# EAGLE design Main Board (EAGLE 9.6.2)
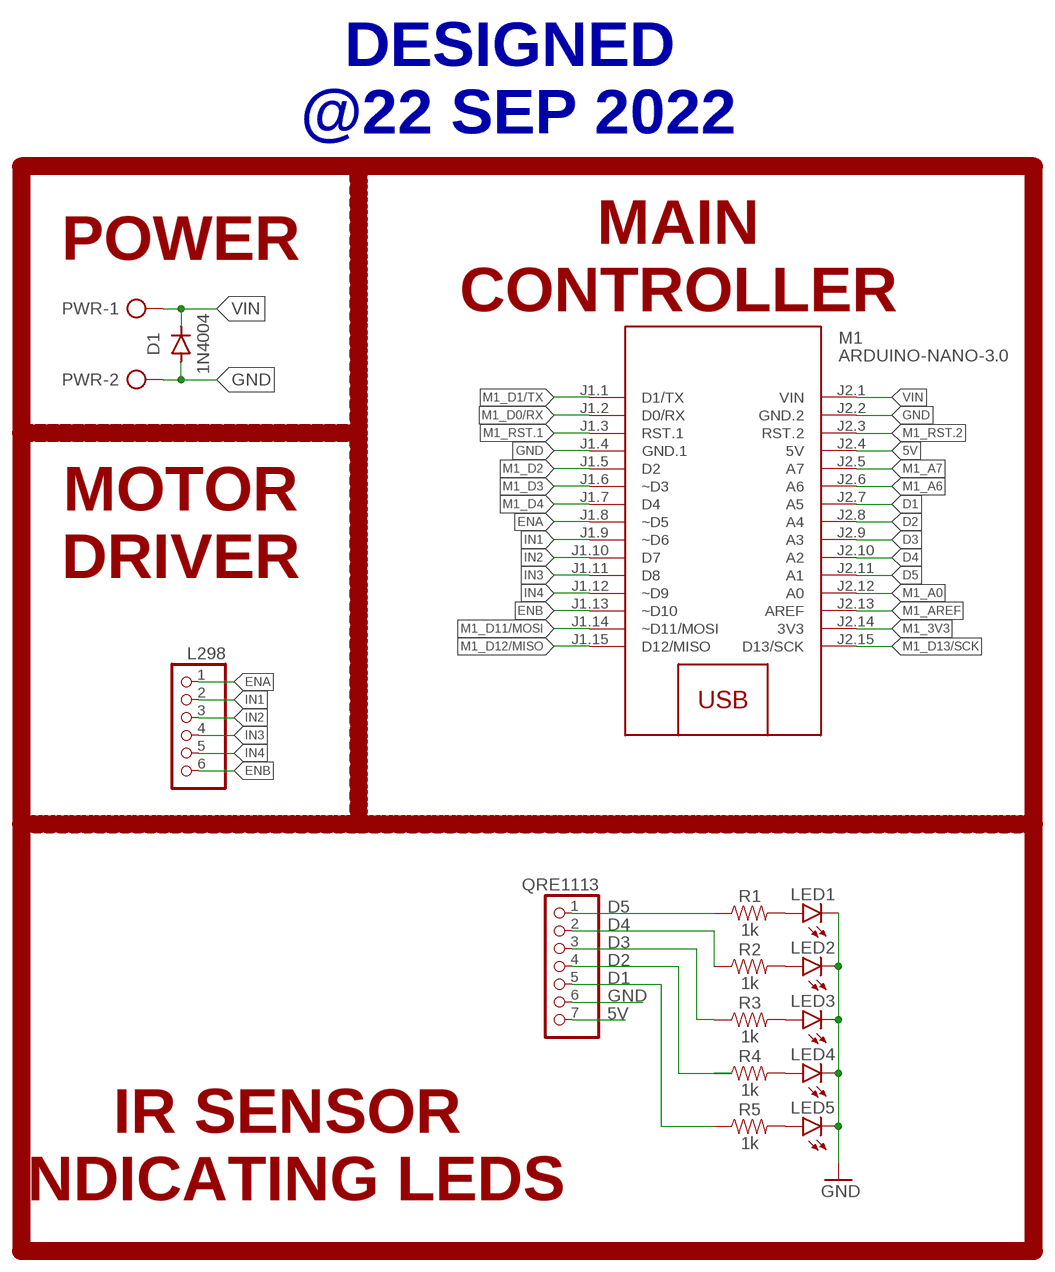
[diagram p0: schematic, sheet 1]

## Parts
D1  1N4004  [DO41-10]
L298  PINHD-1X6  [1X06]
LED1  LED5MM  [LED5MM]
LED2  LED5MM  [LED5MM]
LED3  LED5MM  [LED5MM]
LED4  LED5MM  [LED5MM]
LED5  LED5MM  [LED5MM]
M1  ARDUINO-NANO-3.0  [ARDUINO-NANO-3.0]
PWR  2P  [2P]
QRE1113  PINHD-1X7/90  [1X07/90]
R1  1k  RESISTORAXIAL-0.3  [AXIAL-0.3]
R2  1k  RESISTORAXIAL-0.3  [AXIAL-0.3]
R3  1k  RESISTORAXIAL-0.3  [AXIAL-0.3]
R4  1k  RESISTORAXIAL-0.3  [AXIAL-0.3]
R5  1k  RESISTORAXIAL-0.3  [AXIAL-0.3]

## Nets
5V: M1.J2.4(5V) QRE1113.7
D1: M1.J2.7(A5) QRE1113.5 R5.P$1
D2: M1.J2.8(A4) QRE1113.4 R4.P$1
D3: M1.J2.9(A3) QRE1113.3 R3.P$1
D4: M1.J2.10(A2) QRE1113.2 R2.P$1
D5: M1.J2.11(A1) QRE1113.1 R1.P$1
ENA: L298.1 M1.J1.8(~D5)
ENB: L298.6 M1.J1.13(~D10)
GND: D1.A LED1.K(C) LED2.K(C) LED3.K(C) LED4.K(C) LED5.K(C) M1.J1.4(GND.1) M1.J2.2(GND.2) PWR.2 QRE1113.6
IN1: L298.2 M1.J1.9(~D6)
IN2: L298.3 M1.J1.10(D7)
IN3: L298.4 M1.J1.11(D8)
IN4: L298.5 M1.J1.12(~D9)
M1_3V3: M1.J2.14(3V3)
M1_A0: M1.J2.12(A0)
M1_A6: M1.J2.6(A6)
M1_A7: M1.J2.5(A7)
M1_AREF: M1.J2.13(AREF)
M1_D0/RX: M1.J1.2(D0/RX)
M1_D1/TX: M1.J1.1(D1/TX)
M1_D2: M1.J1.5(D2)
M1_D3: M1.J1.6(~D3)
M1_D4: M1.J1.7(D4)
M1_D11/MOSI: M1.J1.14(~D11/MOSI)
M1_D12/MISO: M1.J1.15(D12/MISO)
M1_D13/SCK: M1.J2.15(D13/SCK)
M1_RST.1: M1.J1.3(RST.1)
M1_RST.2: M1.J2.3(RST.2)
N$1: LED1.A R1.P$2
N$2: LED2.A R2.P$2
N$3: LED3.A R3.P$2
N$4: LED4.A R4.P$2
N$5: LED5.A R5.P$2
VIN: D1.C M1.J2.1(VIN) PWR.1

## Notes on the sheet
- DESIGNED 
  @22 SEP 2022
- POWER
- MAIN
  CONTROLLER
- MOTOR
  DRIVER
- IR SENSOR
  INDICATING LEDS

## Library data of the parts
D1 = diode:1N4004: DIODE general purpose rectifier, 1 A
L298 = pinhead:PINHD-1X6: PIN HEADER
LED1-LED5 = led:LED: LED OSRAM: - CHIPLED LG R971, LG N971, LY N971, LG Q971, LY Q971, LO R971, LY R971 LH N974, LH R974 LS Q976, LO Q976, LY Q976 LO Q996 - Hyper CHIPLED LW Q18S LB Q993, LB Q99A, LB R99A - SideLED LS A670, LO A670, LY A670, LG A670, LP A670 LB A673, LV A673, LT A673, LW A673 LH A674 LY A675 LS A676, LA A676, LO A676, LY A676, LW A676 LS A679, LY A679, LG A679 - Hyper Micro SIDELED® LS Y876, LA Y876, LO Y876, LY Y876 LT Y87S - SmartLED LW L88C, LW L88S LB L89C, LB L89S, LG L890 LS L89K, LO L89K, LY L89K LS L896, LA L896, LO L896, LY L896 - TOPLED LS T670, LO T670, LY T670, LG T670, LP T670 LSG T670, LSP T670, LSY T670, LOP T670, LYG T670 LG T671, LOG T671, LSG T671 LB T673, LV T673, LT T673, LW T673 LH T674 LS T676, LA T676, LO T676, LY T676, LB T676, LH T676, LSB T676, LW T676 LB T67C, LV T67C, LT T67C, LS T67K, LO T67K, LY T67K, LW E67C LS E67B, LA E67B, LO E67B, LY E67B, LB E67C, LV E67C, LT E67C LW T67C LS T679, LY T679, LG T679 LS T770, LO T770, LY T770, LG T770, LP T770 LB T773, LV T773, LT T773, LW T773 LH T774 LS E675, LA E675, LY E675, LS T675 LS T776, LA T776, LO T776, LY T776, LB T776 LHGB T686 LT T68C, LB T68C - Hyper Mini TOPLED® LB M676 - Mini TOPLED Santana® LG M470 LS M47K, LO M47K, LY M47K Source: http://www.osram.convergy.de LUXEON: - LUMILED® LXK2-PW12-R00, LXK2-PW12-S00, LXK2-PW14-U00, LXK2-PW14-V00 LXK2-PM12-R00, LXK2-PM12-S00, LXK2-PM14-U00 LXK2-PE12-Q00, LXK2-PE12-R00, LXK2-PE12-S00, LXK2-PE14-T00, LXK2-PE14-U00 LXK2-PB12-K00, LXK2-PB12-L00, LXK2-PB12-M00, LXK2-PB14-N00, LXK2-PB14-P00, LXK2-PB14-Q00 LXK2-PR12-L00, LXK2-PR12-M00, LXK2-PR14-Q00, LXK2-PR14-R00 LXK2-PD12-Q00, LXK2-PD12-R00, LXK2-PD12-S00 LXK2-PH12-R00, LXK2-PH12-S00 LXK2-PL12-P00, LXK2-PL12-Q00, LXK2-PL12-R00 Source: www.luxeon.com KINGBRIGHT: KA-3528ASYC Source: www.kingbright.com
M1 = Modules:ARDUINO-NANO-3.0: Arduino Nano 3.0 and compatible devices More details available here: https://www.arduino.cc/en/Main/ArduinoBoardNano Click here to find device on ebay.com <http://www.ebay.com/sch/arduino+nano>
PWR = Terminal Block:2P: CONNECTOR
QRE1113 = pinhead:PINHD-1X7: PIN HEADER
R1-R5 = SparkFun-Resistors:RESISTOR: Generic Resistor Package

## Board
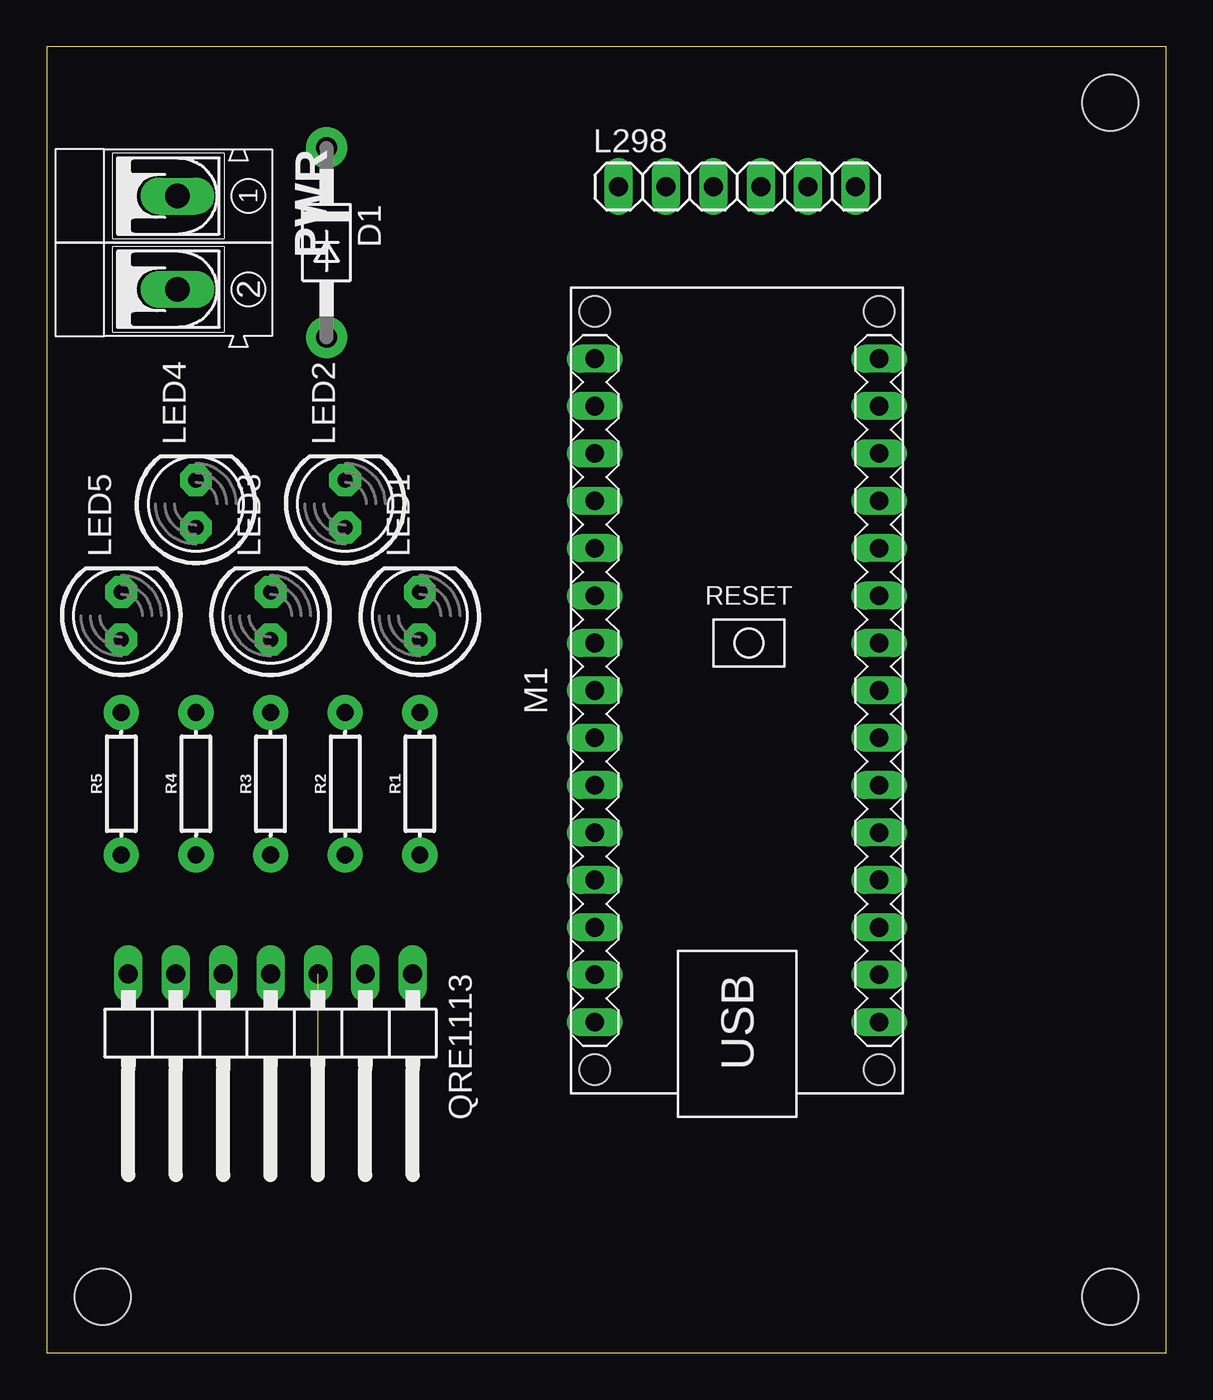
[diagram p1: board, top side]
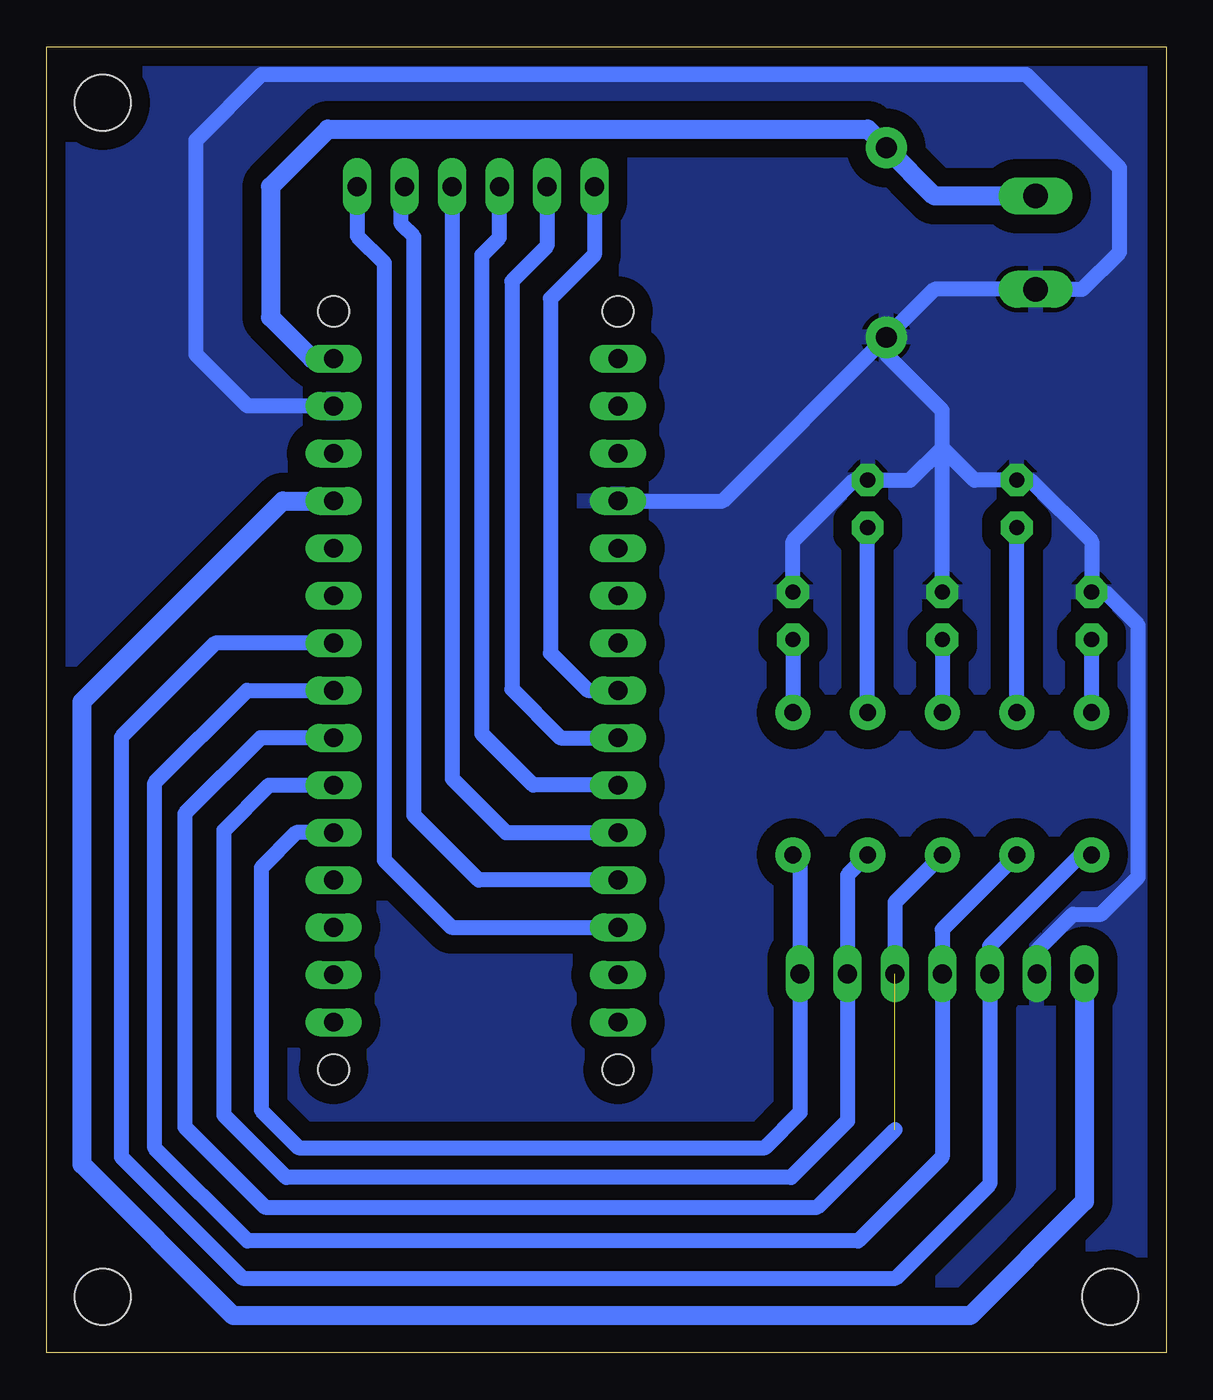
[diagram p2: board, bottom side, seen from below]

Size 60 x 70 mm. Coordinates in mm from the lower left corner, seen from the top.
Outline: 0,0 60,0 60,70 0,70 0,0
Copper layers (1*16): Top 0.035mm / dielectric 1.5mm / Bottom 0.035mm
Design rules "default *": minimum track width 0.8mm, minimum drill 0.7mm, track to track 0.8mm, track to pad 0.8mm, pad to pad 0.8mm, via to via 0.8mm, smd to smd 0.8mm, copper to edge 40mil, drill to drill 6mil, minimum pad ring 10mil, minimum via ring 8mil, stop-mask expansion 4mil, vias tented up to drill 0mil, thermal gap 10mil
Holes 3 mm at 3,3 57,3 57,67

### Footprints (pad centres in the part's own frame; a part is rotated, then mirrored left to right if it is on the bottom)
DO41-10 = drill 1.118 pad 2.2: A 5.08,0; C -5.08,0
1X06 = drill 1.016 long: 1 -6.35,0; 2 -3.81,0; 3 -1.27,0; 4 1.27,0; 5 3.81,0; 6 6.35,0
LED5MM = drill 0.813 pad 1.7 octagon: A -1.27,0; K 1.27,0
ARDUINO-NANO-3.0 = drill 1 long: J1.1 17.78,7.62; J1.2 15.24,7.62; J1.3 12.7,7.62; J1.4 10.16,7.62; J1.5 7.62,7.62; J1.6 5.08,7.62; J1.7 2.54,7.62; J1.8 0,7.62; J1.9 -2.54,7.62; J1.10 -5.08,7.62; J1.11 -7.62,7.62; J1.12 -10.16,7.62; J1.13 -12.7,7.62; J1.14 -15.24,7.62; J1.15 -17.78,7.62; J2.1 17.78,-7.62; J2.2 15.24,-7.62; J2.3 12.7,-7.62; J2.4 10.16,-7.62; J2.5 7.62,-7.62; J2.6 5.08,-7.62; J2.7 2.54,-7.62; J2.8 0,-7.62; J2.9 -2.54,-7.62; J2.10 -5.08,-7.62; J2.11 -7.62,-7.62; J2.12 -10.16,-7.62; J2.13 -12.7,-7.62; J2.14 -15.24,-7.62; J2.15 -17.78,-7.62 | hole 1.651: -20.32,7.62; -20.32,-7.62; 20.32,-7.62; 20.32,7.62
2P = drill 1.321 long: 1 -2.5,0; 2 2.5,0
1X07/90 = drill 1.016 long: 1 -7.62,-3.81; 2 -5.08,-3.81; 3 -2.54,-3.81; 4 0,-3.81; 5 2.54,-3.81; 6 5.08,-3.81; 7 7.62,-3.81
AXIAL-0.3 = drill 0.9 pad 1.88: P$1 -3.81,0; P$2 3.81,0

### Placement (x,y rotation side)
D1  15,59.5 270 top
L298  37,62.5 0 top
LED1  20,39.5 90 top
LED2  16,45.5 90 top
LED3  12,39.5 90 top
LED4  8,45.5 90 top
LED5  4,39.5 90 top
M1  37,35.5 90 top
PWR  7,59.5 270 top
QRE1113  12,16.5 180 top
R1  20,30.5 90 top
R2  16,30.5 90 top
R3  12,30.5 90 top
R4  8,30.5 90 top
R5  4,30.5 90 top

### Tracks (layer width: path | path; a pad name or v marks a point on that pad's centre or on a via)
5V
  Bottom 1.016: M1.J2.4 47.34,45.66 58.1,34.9 58.1,10.1 50,2 10.5,2 4.38,8.12 QRE1113.7
D1
  Bottom 0.8: M1.J2.7 50.96,38.04 56,33 56,10.5 49.5,4 14.5,4 9.46,9.04 QRE1113.5 9.46,21.81 4.58,26.69 R5.P$1
D2
  Bottom 0.8: M1.J2.8 49.26,35.5 54.2,30.56 54.2,10.96 49.24,6 16.5,6 12,10.5 QRE1113.4 12,22.69 R4.P$1
D3  (1 unrouted)
  Bottom 0.8: M1.J2.9 48.54,32.96 52.6,28.9 52.6,12.1 48.3,7.8 18.7,7.8 14.54,11.96 | R3.P$1 14.54,24.15 QRE1113.3
D4
  Bottom 0.8: M1.J2.10 48.08,30.42 50.5,28 50.5,12.74 47.16,9.4 20.1,9.4 17.08,12.42 QRE1113.2 17.08,25.61 R2.P$1
D5
  Bottom 0.8: M1.J2.11 46.62,27.88 48.5,26 48.5,13 46.5,11 21.5,11 19.62,12.88 QRE1113.1 19.62,26.31 R1.P$1
ENA
  Bottom 0.8: L298.1 30.65,58.85 33,56.5 33,37.5 31,35.5 M1.J1.8
ENB
  Bottom 0.8: L298.6 43.35,59.85 41.91,58.41 41.91,26.41 38.3,22.8 M1.J1.13
GND
  Bottom 0.8: LED1.K 20,43.5 16.73,46.77 LED2.K 13.73,46.77 12,48.5 | LED3.K 12,48.5 | 12,48.5 12,50.5 15,53.5 D1.A | 12,48.5 10.27,46.77 LED4.K 7.27,46.77 4,43.5 LED5.K 3.27,40.77 1.5,39 1.5,25.5 3.5,23.5 5,23.5 6.92,21.58 QRE1113.6 | D1.A 12.42,57 PWR.2 4.5,57 2.5,59 2.5,63.5 7.5,68.5 48.5,68.5 52,65 52,53.5 49.24,50.74 M1.J2.2 | M1.J1.4 23.76,45.66 D1.A
  pour Bottom (isolate 1): 0,70 60,70 60,0 0,0
IN1
  Bottom 0.8: L298.2 33.19,59.31 35.07,57.43 35.07,35.57 32.46,32.96 M1.J1.9
IN2
  Bottom 0.8: M1.J1.10 33.92,30.42 36.67,33.17 36.67,58.83 35.73,59.77 L298.3
IN3
  Bottom 0.8: L298.4 38.27,30.77 35.38,27.88 M1.J1.11
IN4
  Bottom 0.8: M1.J1.12 36.84,25.34 40.31,28.81 40.31,59.81 41,60.5 41,62.31 L298.5
N$1
  Bottom 0.8: LED1.A R1.P$2 | R1.P$2
N$2
  Bottom 0.8: R2.P$2 LED2.A | LED2.A
N$3
  Bottom 0.8: LED3.A | LED3.A R3.P$2
N$4
  Bottom 0.8: R4.P$2 | R4.P$2 LED4.A
N$5
  Bottom 0.8: LED5.A | LED5.A R5.P$2
VIN
  Bottom 1.016: PWR.1 12.42,62 D1.C 16,65.58 44.92,65.58 48,62.5 48,55.5 45.78,53.28 M1.J2.1